# Altium schematic sheet Peripherial.SchDoc
size A4; SheetNumber: 3; SheetTotal: 4
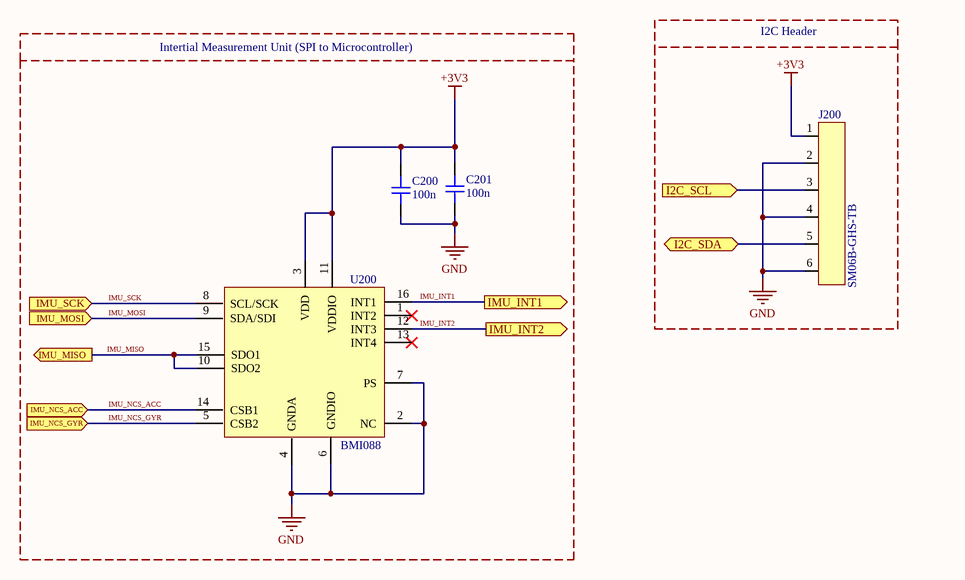
[diagram p0: Peripherial.SchDoc]

## Parts
C200  100n  [CAP_0402]
C201  100n  [CAP_0402]
J200  SM06B-GHS-TB  [SM06B_GHS_TB]
U200  BMI088  [BMI088]

## Blocks framed on the sheet
Intertial Measurement Unit (SPI to Microcontroller): C200 C201 U200
I2C Header: J200

## Ports
I2C_SCL (in), I2C_SDA (bidir), IMU_INT1 (out), IMU_INT2 (out), IMU_MISO (out), IMU_MOSI (in), IMU_NCS_ACC (in), IMU_NCS_GYR (in), IMU_SCK (in)

## Nets
+3V3: C200.2 C201.2 J200.1 U200.3(VDD) U200.11(VDDIO)
GND: C200.1 C201.1 J200.2 J200.4 J200.6 U200.2(NC) U200.4(GNDA) U200.6(GNDIO) U200.7(PS)
I2C_SCL: J200.3 ; port I2C_SCL
I2C_SDA: J200.5 ; port I2C_SDA
IMU_INT1: U200.16(INT1) ; port IMU_INT1
IMU_INT2: U200.12(INT3) ; port IMU_INT2
IMU_MISO: U200.10(SDO2) U200.15(SDO1) ; port IMU_MISO
IMU_MOSI: U200.9(SDA/SDI) ; port IMU_MOSI
IMU_NCS_ACC: U200.14(CSB1) ; port IMU_NCS_ACC
IMU_NCS_GYR: U200.5(CSB2) ; port IMU_NCS_GYR
IMU_SCK: U200.8(SCL/SCK) ; port IMU_SCK

Not connected (* = marked no-connect by the designer): U200 1(INT2)* 13(INT4)*

## Notes on the sheet
- (near J200) Ticari seviye tasarımlarda,  güç pinleri parçası ESD koruması ve filtreleme dekuplaj sağlamalısın.

## Library data of the parts
C200 C201 = CAP_0402_16V: Capacitor SMD 0402 16V
J200 = SM06B-GHS-TB: Header Connector 6 Position 1.25MM Pitch SMD Horizontal JST GH; Manufacturer: JST; Manufacturer Part Number: SM06B-GHS-TB